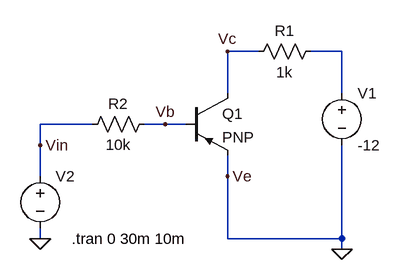
[diagram p0: schematic lab4_2_negative.asc]
lab4_2_negative.asc, the LTspice schematic file:
Version 4
SHEET 1 880 680
WIRE 416 -32 368 -32
WIRE 544 -32 496 -32
WIRE 368 32 368 -32
WIRE 544 32 544 -32
WIRE 160 80 80 80
WIRE 272 80 240 80
WIRE 304 80 272 80
WIRE 80 112 80 80
WIRE 80 160 80 112
WIRE 368 160 368 128
WIRE 80 256 80 240
WIRE 368 256 368 160
WIRE 544 256 544 112
WIRE 544 256 368 256
WIRE 544 272 544 256
FLAG 272 80 Vb
FLAG 368 -32 Vc
FLAG 80 112 Vin
FLAG 80 256 0
FLAG 368 160 Ve
FLAG 544 272 0
SYMBOL voltage 80 144 R0
WINDOW 3 24 96 Invisible 2
WINDOW 123 0 0 Left 0
WINDOW 39 0 0 Left 0
SYMATTR Value PULSE(0 -12 10e-3 10e-3 10e-3 10e-3 30e-3 1)
SYMATTR InstName V2
SYMBOL res 144 96 R270
WINDOW 0 32 56 VTop 2
WINDOW 3 0 56 VBottom 2
SYMATTR InstName R2
SYMATTR Value 10k
SYMBOL res 512 -48 R90
WINDOW 0 0 56 VBottom 2
WINDOW 3 32 56 VTop 2
SYMATTR InstName R1
SYMATTR Value 1k
SYMBOL voltage 544 16 R0
WINDOW 123 0 0 Left 0
WINDOW 39 0 0 Left 0
SYMATTR InstName V1
SYMATTR Value -12
SYMBOL pnp 304 32 R0
SYMATTR InstName Q1
TEXT 128 256 Left 2 !.tran 0 30m 10m

The netlist it stands for:
* lab4_2_negative.asc
V2 Vin 0 PULSE(0 -12 10e-3 10e-3 10e-3 10e-3 30e-3 1)
R2 Vin Vb 10k
R1 N001 Vc 1k
V1 N001 0 -12
Q1 Vc Vb 0 0 PNP
.model NPN NPN
.model PNP PNP
.lib standard.bjt
.tran 0 30m 10m
.backanno
.end